# Altium schematic sheet main.SchDoc
size A4
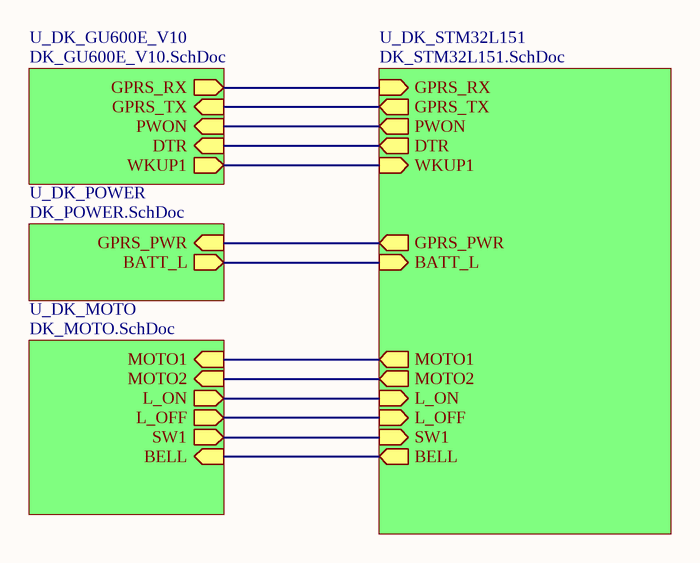
[diagram p0: main.SchDoc]

## Sub-sheets
U_DK_GU600E_V10 = DK_GU600E_V10.SchDoc: GPRS_RX (out), GPRS_TX (in), PWON (in), DTR (in), WKUP1 (out)
U_DK_MOTO = DK_MOTO.SchDoc: MOTO1 (in), MOTO2 (in), L_OFF (out), L_ON (out), SW1 (out), BELL (in)
U_DK_POWER = DK_POWER.SchDoc: GPRS_PWR (in), BATT_L (out)
U_DK_STM32L151 = DK_STM32L151.SchDoc: GPRS_TX (out), GPRS_RX (in), PWON (out), GPRS_PWR (out), MOTO1 (out), MOTO2 (out), BATT_L (in), L_ON (in), L_OFF (in), SW1 (in), DTR (out), BELL (out), WKUP1 (in)

## Nets
(unnamed): sheet U_DK_STM32L151/GPRS_TX, sheet U_DK_GU600E_V10/GPRS_TX
(unnamed): sheet U_DK_STM32L151/GPRS_RX, sheet U_DK_GU600E_V10/GPRS_RX
(unnamed): sheet U_DK_STM32L151/PWON, sheet U_DK_GU600E_V10/PWON
(unnamed): sheet U_DK_STM32L151/GPRS_PWR, sheet U_DK_POWER/GPRS_PWR
(unnamed): sheet U_DK_STM32L151/MOTO1, sheet U_DK_MOTO/MOTO1
(unnamed): sheet U_DK_STM32L151/MOTO2, sheet U_DK_MOTO/MOTO2
(unnamed): sheet U_DK_STM32L151/BATT_L, sheet U_DK_POWER/BATT_L
(unnamed): sheet U_DK_STM32L151/L_ON, sheet U_DK_MOTO/L_ON
(unnamed): sheet U_DK_STM32L151/L_OFF, sheet U_DK_MOTO/L_OFF
(unnamed): sheet U_DK_STM32L151/SW1, sheet U_DK_MOTO/SW1
(unnamed): sheet U_DK_STM32L151/DTR, sheet U_DK_GU600E_V10/DTR
(unnamed): sheet U_DK_STM32L151/BELL, sheet U_DK_MOTO/BELL
(unnamed): sheet U_DK_STM32L151/WKUP1, sheet U_DK_GU600E_V10/WKUP1